# EAGLE design mosamp (EAGLE 7.1.0)
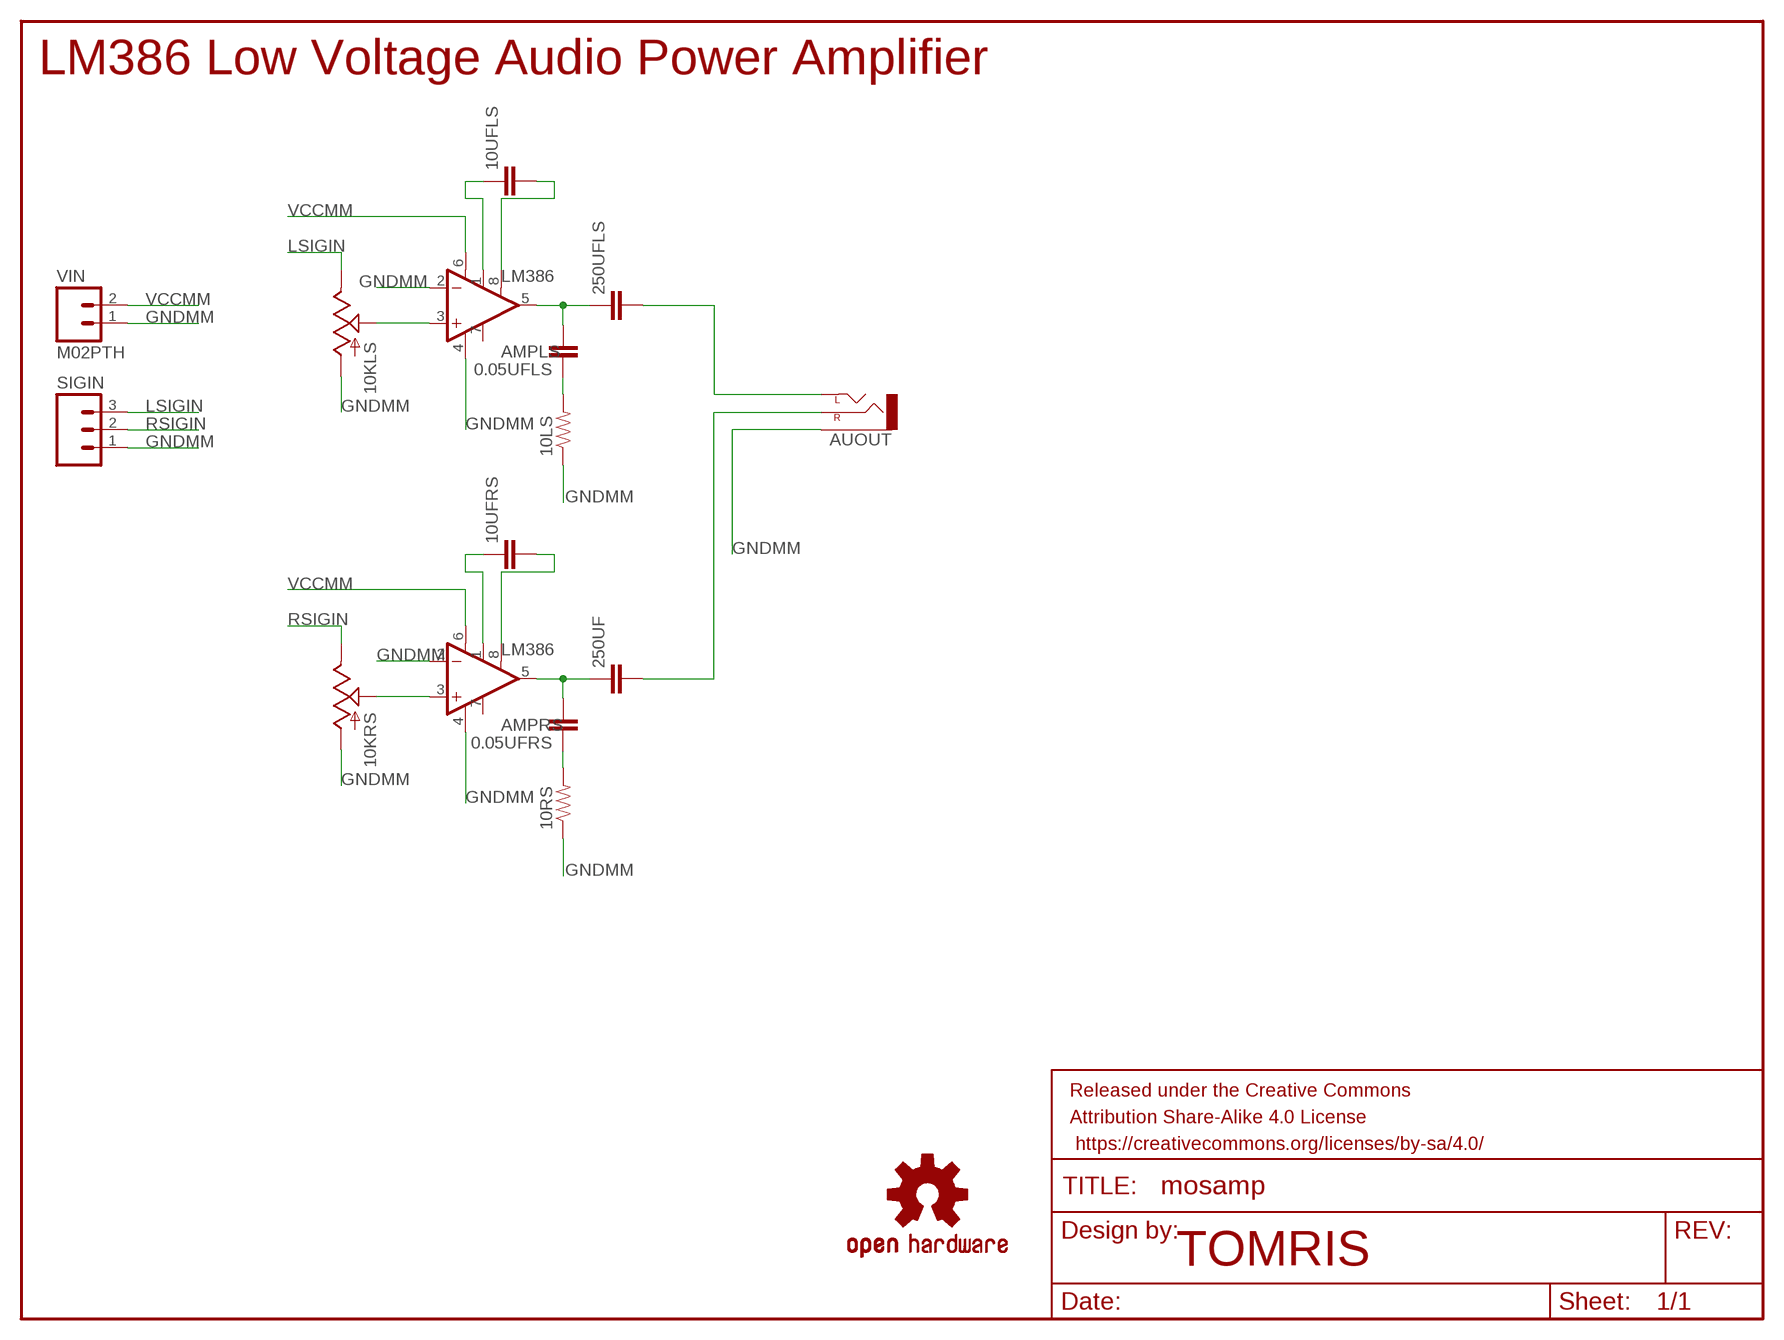
[diagram p0: schematic, sheet 1]

## Parts
0.05UFLS  CAPPTH  [CAP-PTH-SMALL]
0.05UFRS  CAPPTH  [CAP-PTH-SMALL]
10KLS  POTMAM  [POT_MAMMOTH]
10KRS  POTMAM  [POT_MAMMOTH]
10LS  RESISTORAXIAL-0.3  [AXIAL-0.3]
10RS  RESISTORAXIAL-0.3  [AXIAL-0.3]
10UFLS  CAPPTH  [CAP-PTH-SMALL]
10UFRS  CAPPTH  [CAP-PTH-SMALL]
250UF  CAPPTH  [CAP-PTH-SMALL]
250UFLS  CAPPTH  [CAP-PTH-SMALL]
AMPLS  LM386  [DIP08]
AMPRS  LM386  [DIP08]
AUOUT  AUDIO-JACK2.5MM  [STEREOJACK2.5MM_STEREOJACK2.5MM]
FRAME1  FRAME-LETTER  [CREATIVE_COMMONS]
LOGO1  OSHW-LOGOM  [OSHW-LOGO-M]
SIGIN  M03PTH  [1X03]
VIN  M02PTH  [1X02]

## Nets
GNDMM: 10KLS.P$2(A) 10KRS.P$2(A) 10LS.P$1 10RS.P$1 AMPLS.2(-IN) AMPLS.4(V-) AMPRS.2(-IN) AMPRS.4(V-) AUOUT.RING1(SLEEVE) SIGIN.1 VIN.1
LSIGIN: 10KLS.P$3(E) SIGIN.3
N$1: 10UFRS.1 AMPRS.1(GAIN)
N$2: 10UFRS.2 AMPRS.8(GAIN)
N$3: 0.05UFRS.2 250UF.1 AMPRS.5(OUT)
N$4: 10KRS.P$1(S) AMPRS.3(+IN)
N$5: 250UFLS.2 AUOUT.SHIELD(LEFT)
N$6: 250UF.2 AUOUT.TIP(RIGHT)
N$7: 0.05UFRS.1 10RS.P$2
N$9: 10UFLS.1 AMPLS.1(GAIN)
N$10: 10UFLS.2 AMPLS.8(GAIN)
N$11: 0.05UFLS.2 250UFLS.1 AMPLS.5(OUT)
N$12: 10KLS.P$1(S) AMPLS.3(+IN)
N$15: 0.05UFLS.1 10LS.P$2
RSIGIN: 10KRS.P$3(E) SIGIN.2
VCCMM: AMPLS.6(V+) AMPRS.6(V+) VIN.2
Unconnected: AMPLS.7(BP) AMPRS.7(BP)

## Notes on the sheet
- LM386 Low Voltage Audio Power Amplifier
- TOMRIS

## Library data of the parts
0.05UFLS 0.05UFRS 10UFLS 10UFRS 250UF 250UFLS = SparkFun-Capacitors:CAP: Capacitor Standard 0603 ceramic capacitor, and 0.1" leaded capacitor.
10KLS 10KRS = SparkFun-Electromechanical:POT
10LS 10RS = SparkFun-Resistors:RESISTOR: Resistor Basic schematic elements and footprints for 0603, 1206, and PTH resistors.
AMPLS AMPRS = SparkFun-AnalogIC:LM386: low voltage audio power amplifier
AUOUT = SparkFun-Connectors:AUDIO-JACK: 3.5mm Audio Jack Simple 3.5mm common PCB mount audio jack. SKU: PRT-08032
FRAME1 = SparkFun-Aesthetics:FRAME-LETTER: Schematic Frame Standard 8.5x11 US Letter frame
LOGO1 = OSHW-LOGO-M-BOTTOMCOP:OSHW-LOGO: Open Source Hardware Logo This logo indicates the piece of hardware it is found on incorporates a OSHW license and/or adheres to the definition of open source hardware found here: http://freedomdefined.org/OSHW
SIGIN = SparkFun-Connectors:M03: Header 3 Standard 3-pin 0.1" header. Use with straight break away headers (SKU : PRT-00116), right angle break away headers (PRT-00553), swiss pins (PRT-00743), machine pins (PRT-00117), and female headers (PRT-00115). Molex polarized connector foot print use with SKU : PRT-08232 with associated crimp pins and housings.
VIN = SparkFun-Connectors:M02: Standard 2-pin 0.1" header. Use with - straight break away headers ( PRT-00116) - right angle break away headers (PRT-00553) - swiss pins (PRT-00743) - machine pins (PRT-00117) - female headers (PRT-00115) Molex polarized connector foot print use with: PRT-08233 with associated crimp pins and housings. 2.54_SCREWTERM for use with PRT-10571. 3.5mm Screw Terminal footprints for PRT-08084 5mm Screw Terminal footprints for use with PRT-08432

## Board
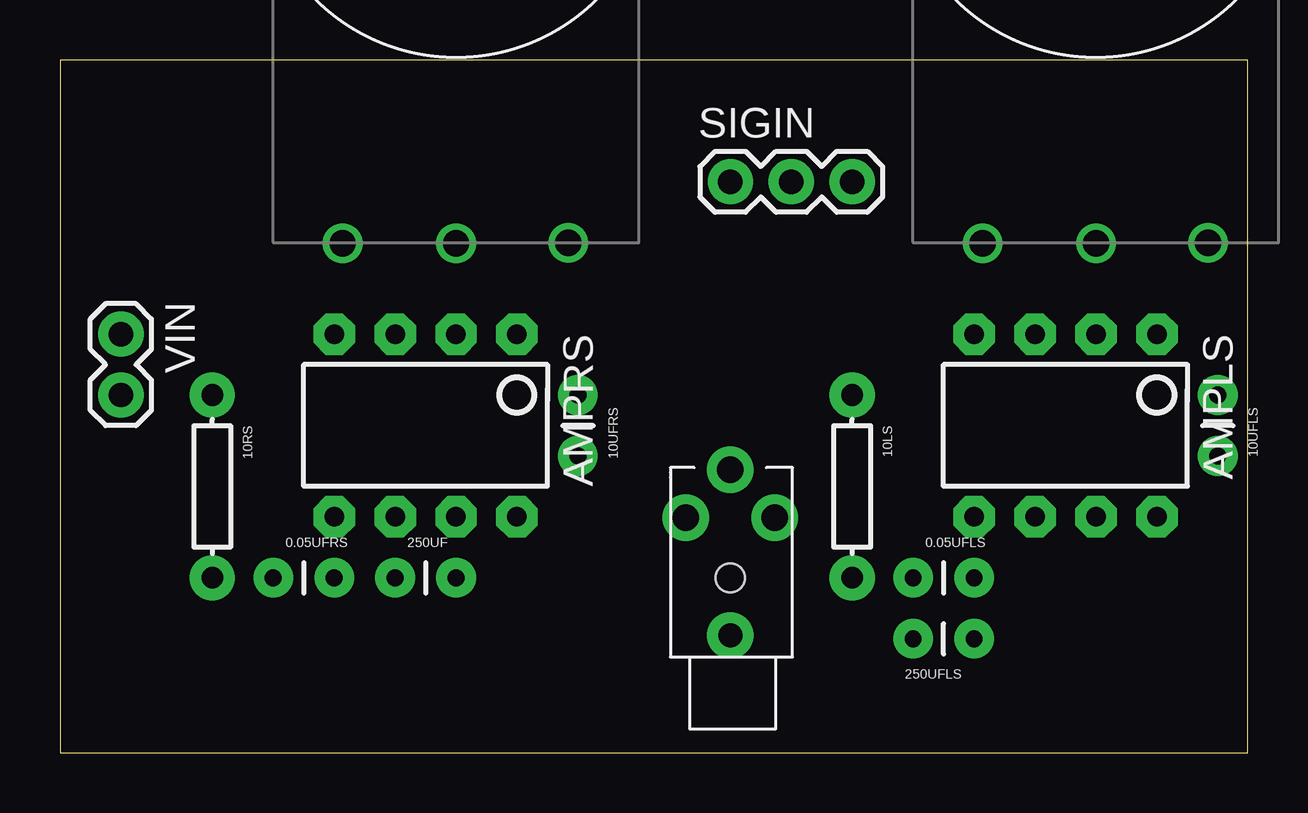
[diagram p1: board, top side]
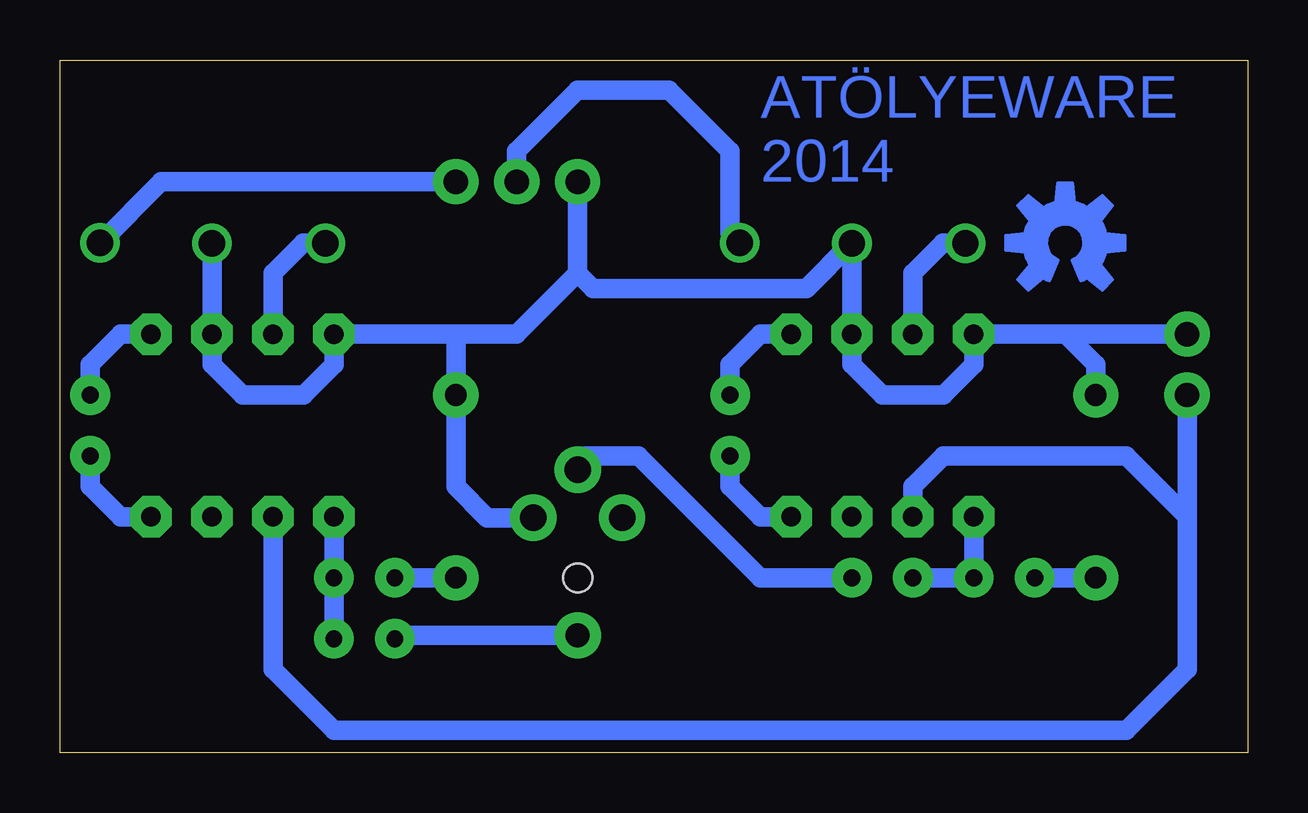
[diagram p2: board, bottom side, seen from below]

Size 49.52 x 28.88 mm. Coordinates in mm from the lower left corner, seen from the top.
Outline: 0,28.88 0,0 49.52,0 49.52,28.88 0,28.88
Copper layers (1*16): Top 0.035mm / dielectric 1.5mm / Bottom 0.035mm
Design rules "default": minimum track width 10mil, minimum drill 24mil, track to track 8mil, track to pad 8mil, pad to pad 8mil, via to via 8mil, smd to smd 8mil, copper to edge 40mil, drill to drill 8mil, minimum pad ring 10mil, minimum via ring 8mil, stop-mask expansion 4mil, vias tented up to drill 0mil, thermal gap 10mil

### Footprints (pad centres in the part's own frame; a part is rotated, then mirrored left to right if it is on the bottom)
CAP-PTH-SMALL = drill 0.7 pad 1.651: 1 0,0; 2 2.54,0
POT_MAMMOTH = drill 1.1: P$1 -4.73,-0.02; P$2 0,-0.02; P$3 4.67,-0.01
AXIAL-0.3 = drill 0.9 pad 1.88: P$1 -3.81,0; P$2 3.81,0
DIP08 = drill 0.813 pad 1.727 octagon: 1 -3.81,-3.81; 2 -1.27,-3.81; 3 1.27,-3.81; 4 3.81,-3.81; 5 3.81,3.81; 6 1.27,3.81; 7 -1.27,3.81; 8 -3.81,3.81
STEREOJACK2.5MM_STEREOJACK2.5MM = drill 1.1 pad 1.93: RING1 2.5,-1.85; RING2 2.5,1.85; TIP 4.5,0 | drill 1 pad 1.93: SHIELD -2.4,0 | hole 1.2: 0,0
1X03 = drill 1.016 pad 1.88: 1 0,0; 2 2.54,0; 3 5.08,0
1X02 = drill 1.016 pad 1.88: 1 0,0; 2 2.54,0

### Placement (x,y rotation side)
0.05UFLS  35.56,7.29 0 top
0.05UFRS  8.89,7.29 0 top
10KLS  43.18,21.26 0 top
10KRS  16.51,21.26 0 top
10LS  33.02,11.1 270 top
10RS  6.35,11.1 270 top
10UFLS  48.26,14.91 270 top
10UFRS  21.59,14.91 270 top
250UF  13.97,7.29 0 top
250UFLS  38.1,4.75 180 top
AMPLS  41.91,13.64 180 top
AMPRS  15.24,13.64 180 top
AUOUT  27.94,7.29 90 top
FRAME1  2.54,-9.22 0 top  (outside the outline)
LOGO1  7.62,21.26 0 top
SIGIN  27.94,23.8 0 top
VIN  2.54,17.45 270 top

### Tracks (layer width: path | path; a pad name or v marks a point on that pad's centre or on a via)
GNDMM
  Bottom 0.813: 10KLS.P$2 AMPLS.2 43.18,16.18 41.91,14.91 39.37,14.91 38.1,16.18 AMPLS.4 33.02,17.45 | SIGIN.1 27.94,19.99 | 27.94,19.99 30.48,17.45 33.02,17.45 | 27.94,19.99 27.3,19.36 18.41,19.36 16.53,21.24 10KRS.P$2 AMPRS.2 16.51,16.18 15.24,14.91 12.7,14.91 11.43,16.18 AMPRS.4 7.62,17.45 | 33.02,17.45 10LS.P$1 33.02,11.1 31.71,9.79 AUOUT.RING1 | VIN.1 7.62,17.45 | 10RS.P$1 6.35,16.18 7.62,17.45
LSIGIN
  Bottom 0.813: SIGIN.3 45.3,23.8 10KLS.P$3
N$1
  Bottom 0.813: AMPRS.1 20.32,17.45 21.59,16.18 10UFRS.1
N$2
  Bottom 0.813: AMPRS.8 20.32,9.83 21.59,11.1 10UFRS.2
N$3
  Bottom 0.813: AMPRS.5 0.05UFRS.2 250UF.1
N$4
  Bottom 0.813: 10KRS.P$1 12.72,21.24 13.97,19.99 AMPRS.3
N$5
  Bottom 0.813: AUOUT.SHIELD 35.42,4.89 250UFLS.2
N$6
  Bottom 0.813: 250UF.2 20.32,7.29 25.4,12.37 27.94,12.37 AUOUT.TIP
N$7
  Bottom 0.813: 10RS.P$2 0.05UFRS.1
N$9
  Bottom 0.813: AMPLS.1 46.99,17.45 48.26,16.18 10UFLS.1
N$10
  Bottom 0.813: AMPLS.8 46.99,9.83 48.26,11.1 10UFLS.2
N$11
  Bottom 0.813: AMPLS.5 0.05UFLS.2 250UFLS.1
N$12
  Bottom 0.813: 10KLS.P$1 39.39,21.24 40.64,19.99 AMPLS.3
N$15
  Bottom 0.813: 10LS.P$2 0.05UFLS.1
RSIGIN
  Bottom 0.813: SIGIN.2 30.48,25.07 27.94,27.61 24.13,27.61 21.59,25.07 21.59,21.66 10KRS.P$3
VCCMM
  Bottom 0.813: AMPLS.6 40.64,3.48 38.1,0.94 5.08,0.94 2.54,3.48 2.54,9.83 | 2.54,9.83 5.08,12.37 12.7,12.37 13.97,11.1 AMPRS.6 | VIN.2 2.54,9.83

### Text on the board
Bottom: ATÖLYEWARE / 2014